# Altium schematic sheet M66 Quectel.SchDoc
size A2; SheetNumber: 1; SheetTotal: 1
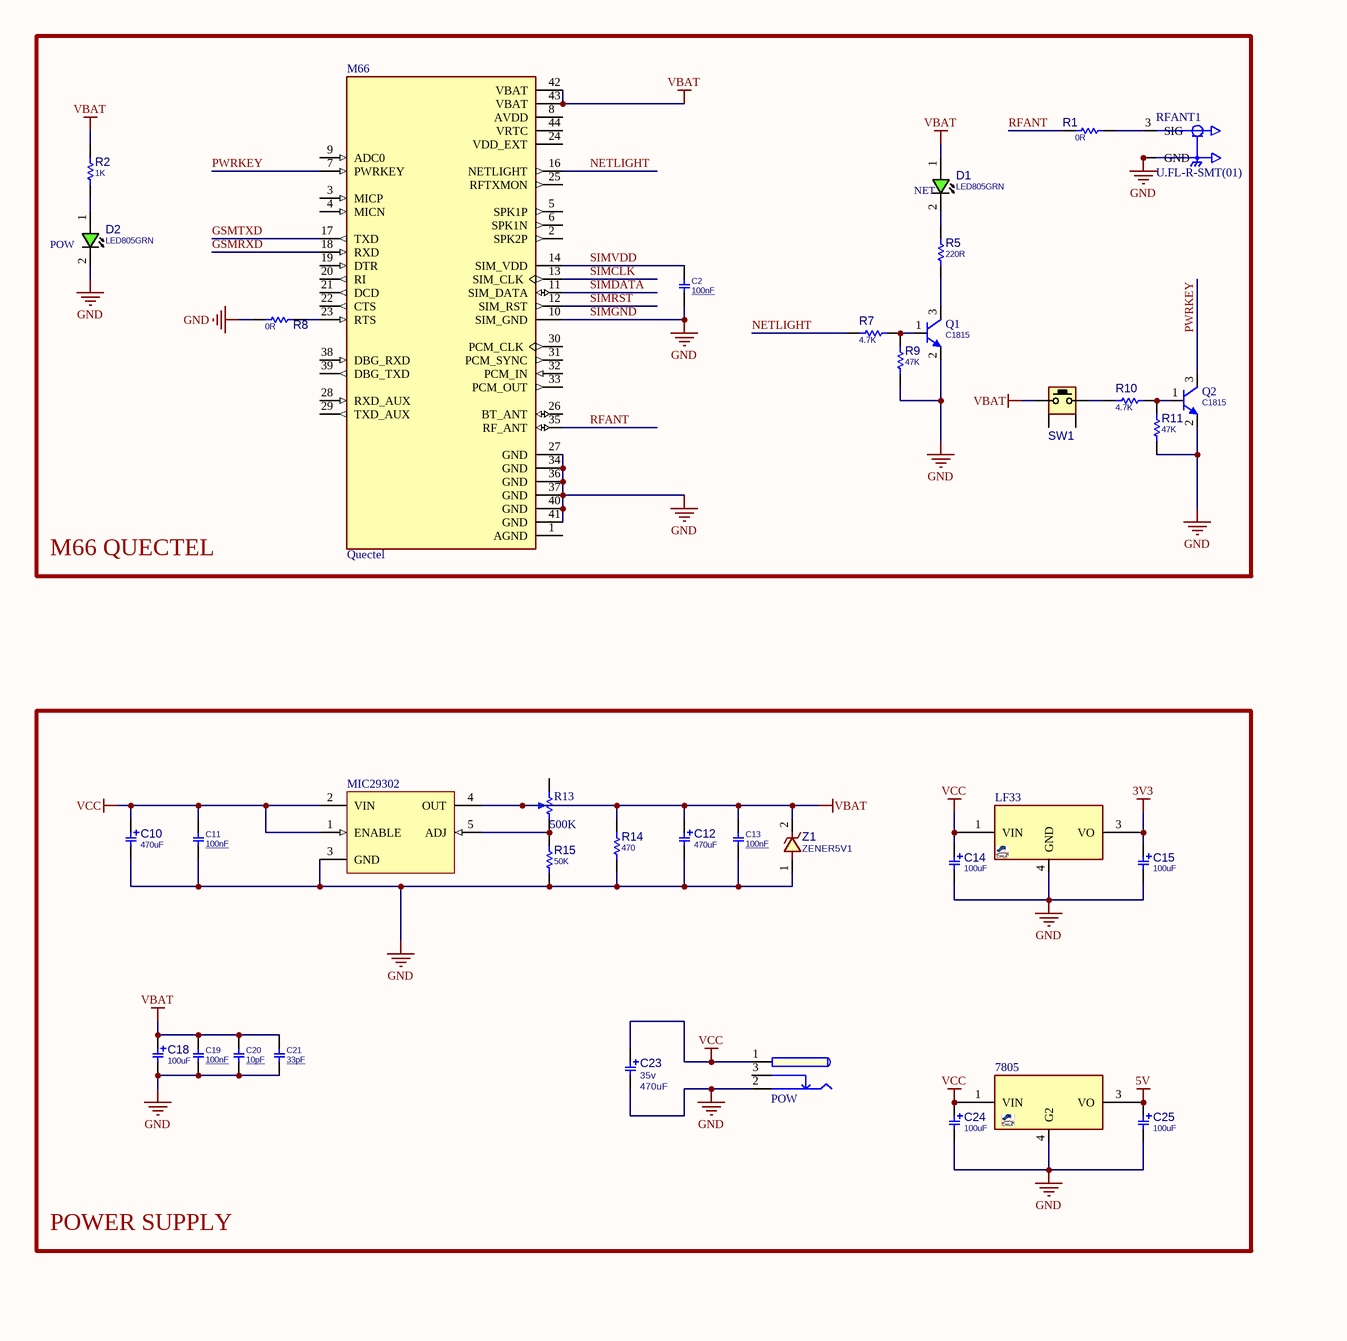
[diagram p0: M66 Quectel.SchDoc, left]
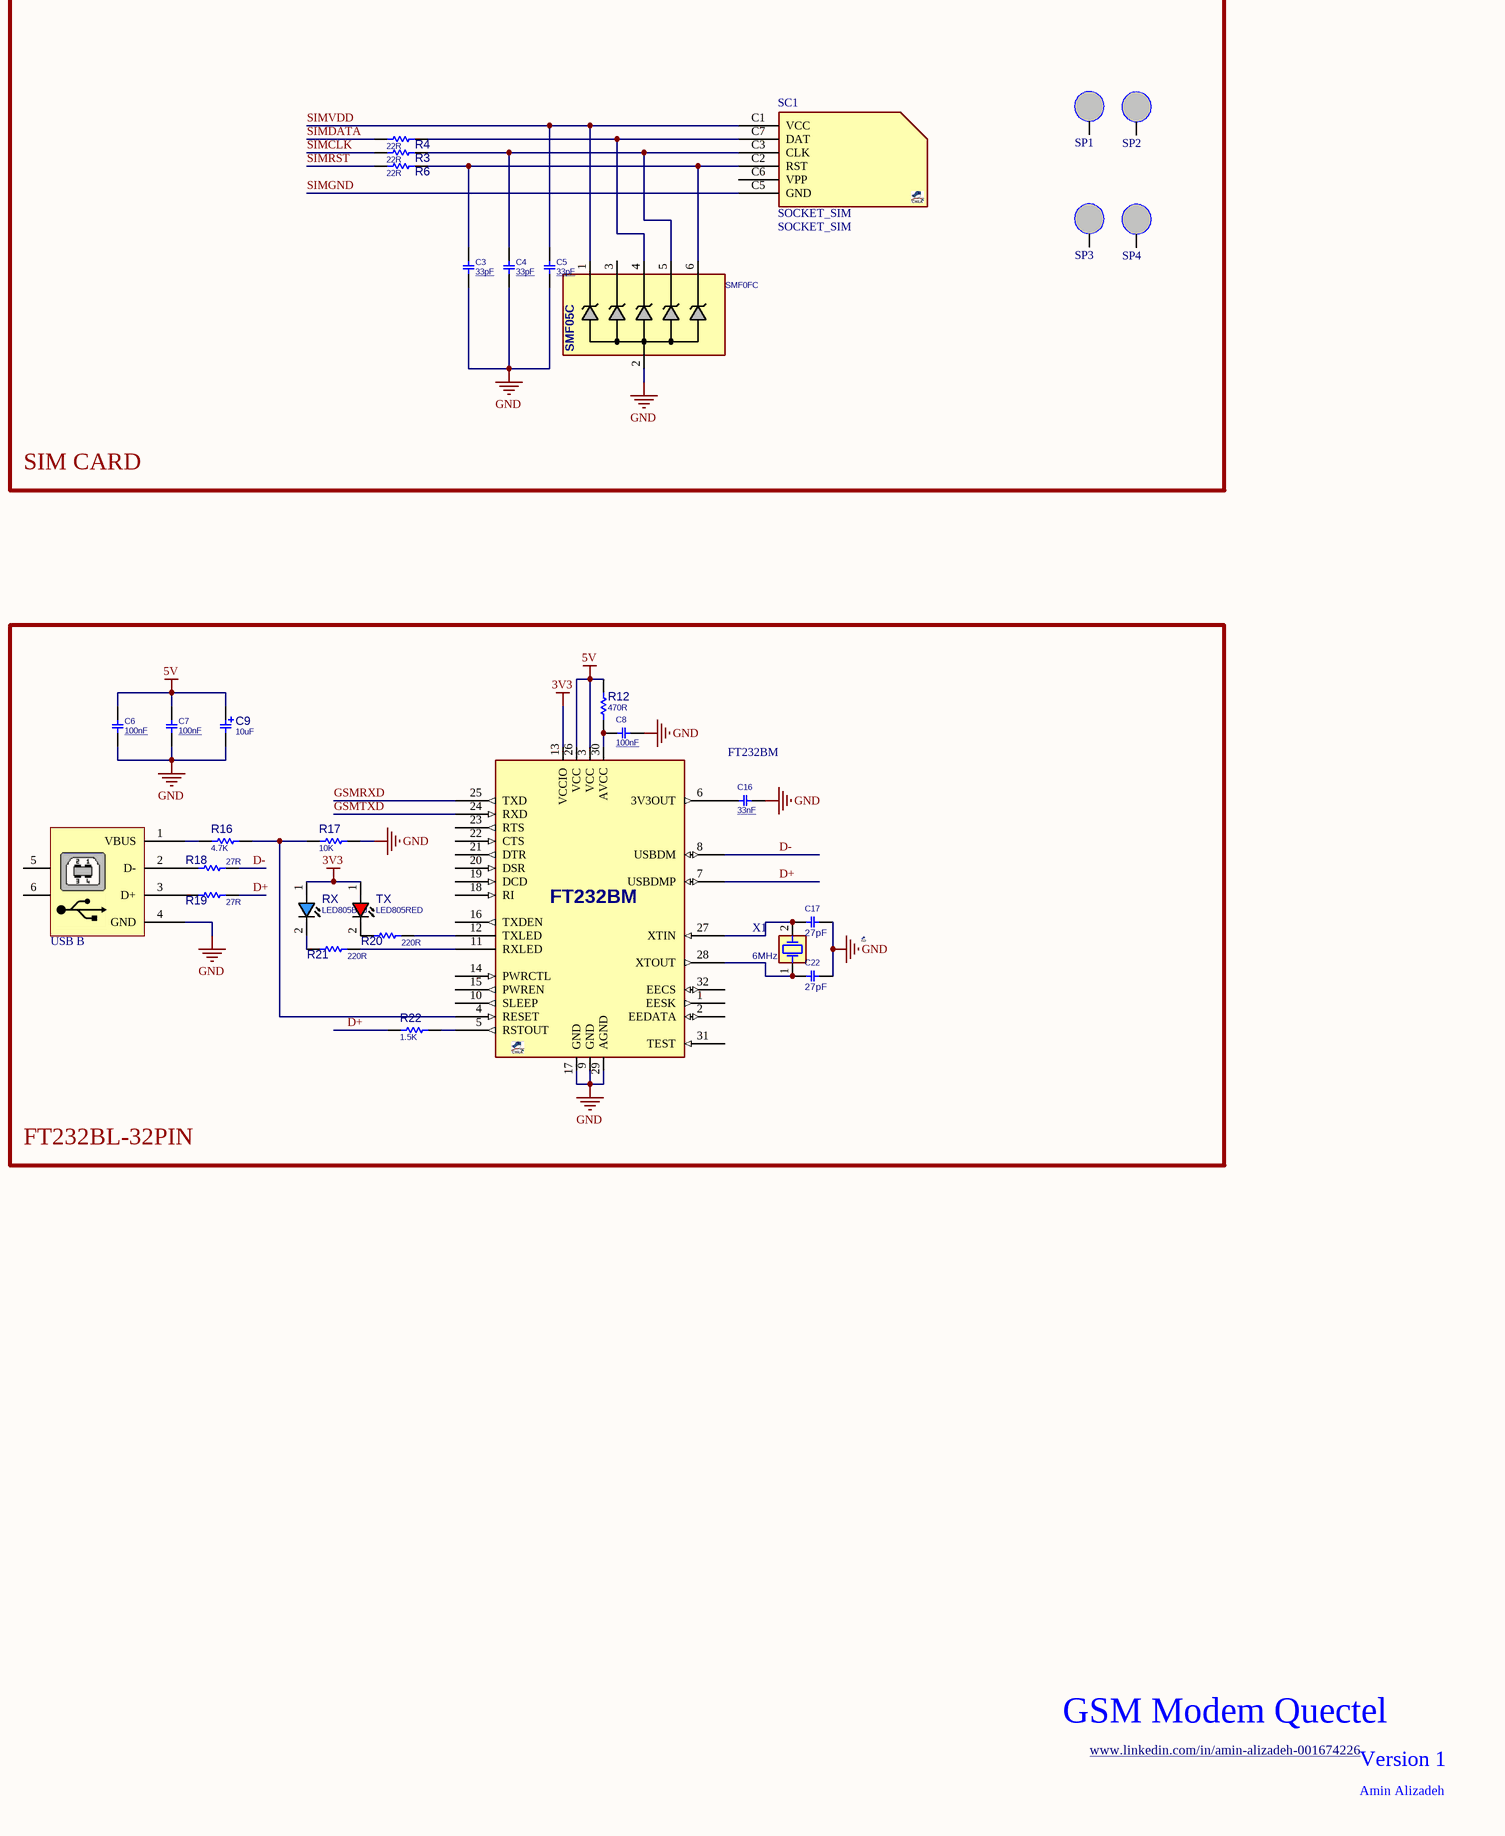
[diagram p1: M66 Quectel.SchDoc, right]

## Parts
7805  7805  [D2PAK_2]  (value not drawn)
C2  100nF  [C0805]
C3  33pF  [C0805]
C4  33pF  [C0805]
C5  33pF  [C0805]
C6  100nF  [C0805]
C7  100nF  [C0805]
C8  100nF  [C0805]
C9  10uF  [SMD_Cap_10x10]
C10  470uF  [SMD_Cap_10x10]
C11  100nF  [C0805]
C12  470uF  [SMD_Cap_10x10]
C13  100nF  [C0805]
C14  100uF  [Cap 5.3 x 6.3]
C15  100uF  [Cap 5.3 x 6.3]
C16  33nF  [C0805]
C17  27pF  [C0805]
C18  100uF  [SMD_Cap_10x10]
C19  100nF  [C0805]
C20  10pF  [C0805]
C21  33pF  [C0805]
C22  27pF  [C0805]
C23  PARAM2: 35v  [SMD_Cap_10x10]  (hidden comment: 470uF)
C24  100uF  [Cap 5.3 x 6.3]
C25  100uF  [Cap 5.3 x 6.3]
D1  NET  value LED805GRN  [LED0805GRN]
D2  POW  value LED805GRN  [LED0805GRN]
FT232BM  FT232BM  [QFG80_32]  (value not drawn)
LF33  LF33  [DPAK_3]  (value not drawn)
M66  Quectel  [XCVR_M66]
MIC29302  MIC29XX  [D2PAK_5]  (value not drawn)
POW  DC Power Jack  [DC_Power_Jack]  (value not drawn)
Q1  C1815  [SOT23_3]
Q2  C1815  [SOT23_3]
R1  0R  [R0805]
R2  1K  [R0805]
R3  22R  [R0805]
R4  22R  [R0805]
R5  220R  [R0805]
R6  22R  [R0805]
R7  4.7K  [R0805]
R8  0R  [R0805]
R9  47K  [R0805]
R10  4.7K  [R0805]
R11  47K  [R0805]
R12  470R  [R0805]
R13  value 500K  [POT_3296W]  (hidden comment: Multi_turn)
R14  470  [R0805]
R15  50K  [R0805]
R16  4.7K  [R0805]
R17  10K  [R0805]
R18  27R  [R0805]
R19  27R  [R0805]
R20  220R  [R0805]
R21  220R  [R0805]
R22  1.5K  [R0805]
RFANT1  U.FL-R-SMT(01)  [HRS_U.FL-R-SMT(01)]
RX  LED805BLU  [LED0805BLU]
SC1  SOCKET_SIM  [SIM_MINI_6JT]
SMF0FC  TVS_SMF05C  [SOT363_6]  (value not drawn)
SP1  Spacer  [my_space]  (value not drawn)
SP2  Spacer  [my_space]  (value not drawn)
SP3  Spacer  [my_space]  (value not drawn)
SP4  Spacer  [my_space]  (value not drawn)
SW1  POW ON  [SWPBT_SPST_R_6X6X10]  (value not drawn)
TX  LED805RED  [LED0805RED]
USB_B  USB_B  [USB_B.1]  (value not drawn)
X1  6MHz  [XTL_2_11X5]
Z1  ZENER5V1  [D_SOD123W]

## Blocks framed on the sheet
M66 QUECTEL: C2 D1 D2 M66 Q1 Q2 R1 R2 R5 R7-R11 RFANT1 SW1
SIM CARD: C3-C5 R3 R4 R6 SC1 SMF0FC SP1-SP4
POWER SUPPLY: 7805 C10-C15 C18-C21 C23-C25 LF33 MIC29302 POW R13-R15 Z1
FT232BL-32PIN: C6-C9 C16 C17 C22 FT232BM R12 R16-R22 RX TX USB_B X1

## Nets
3V3: C15.1 FT232BM.13(VCCIO) LF33.3(VO) RX.1(ANODE) TX.1(ANODE)
5V: 7805.3(VO) C6.1 C7.1 C9.1 C25.1 FT232BM.3(VCC) FT232BM.26(VCC) R12.2
SIMGND: 7805.4(G2) C2.1 C3.1 C4.1 C5.1 C6.2 C7.2 C8.1 C9.2 C10.2 C11.1 C12.2 C13.1 C14.2 C15.2 C16.2 C17.1 C18.2 C19.1 C20.1 C21.1 C22.1 C23.2 C24.2 C25.2 D2.2(CATHODE) FT232BM.9(GND) FT232BM.17(GND) FT232BM.29(AGND) LF33.4(GND) M66.10(SIM_GND) M66.27(GND) M66.34(GND) M66.36(GND) M66.37(GND) M66.40(GND) M66.41(GND) MIC29302.3(GND) POW.2(GND) Q1.2(E) Q2.2(E) R8.2 R9.1 R11.1 R14.1 R15.1 R17.2 RFANT1.1(GND) RFANT1.2(GND) SC1.C5(GND) SMF0FC.2 USB_B.4(GND) Z1.1  [also labelled GND]
VBAT: C12.1 C13.2 C18.1 C19.2 C20.2 C21.2 D1.1(ANODE) M66.42(VBAT) M66.43(VBAT) MIC29302.4(OUT) R2.2 R13.3(TAP) R14.2 SW1.1 Z1.2
VCC: 7805.1(VIN) C10.1 C11.2 C14.1 C23.1 C24.1 LF33.1(VIN) MIC29302.1(ENABLE) MIC29302.2(VIN) POW.1(V+)
D+: FT232BM.7(USBDMP) R19.1 R22.2
D-: FT232BM.8(USBDM) R18.1
GSMRXD: FT232BM.25(TXD) M66.18(RXD)
GSMTXD: FT232BM.24(RXD) M66.17(TXD)
NETLIGHT: M66.16(NETLIGHT) R7.2
PWRKEY: M66.7(PWRKEY) Q2.3(C)
RFANT: M66.35(RF_ANT) R1.2
SIMCLK: M66.13(SIM_CLK) R3.2
SIMDATA: M66.11(SIM_DATA) R4.2
SIMRST: M66.12(SIM_RST) R6.2
SIMVDD: C2.2 C5.2 M66.14(SIM_VDD) SC1.C1(VCC) SMF0FC.1
NetC3_2: C3.2 R6.1 SC1.C2(RST) SMF0FC.6
NetC4_2: C4.2 R3.1 SC1.C3(CLK) SMF0FC.5
NetC8_2: C8.2 FT232BM.30(AVCC) R12.1
NetC16_1: C16.1 FT232BM.6(3V3OUT)
NetC17_2: C17.2 FT232BM.27(XTIN) X1.2(OSC2)
NetC22_2: C22.2 FT232BM.28(XTOUT) X1.1(OSC1)
NetD1_2: D1.2(CATHODE) R5.2
NetD2_1: D2.1(ANODE) R2.1
NetFT232BM_4: FT232BM.4(RESET) R16.2 R17.1
NetFT232BM_5: FT232BM.5(RSTOUT) R22.1
NetFT232BM_11: FT232BM.11(RXLED) R21.1
NetFT232BM_12: FT232BM.12(TXLED) R20.1
NetM66_23: M66.23(RTS) R8.1
NetMIC29302_5: MIC29302.5(ADJ) R13.2(BOT) R15.2
NetQ1_1: Q1.1(B) R7.1 R9.2
NetQ1_3: Q1.3(C) R5.1
NetQ2_1: Q2.1(B) R10.1 R11.2
NetR1_1: R1.1 RFANT1.3(SIG)
NetR4_1: R4.1 SC1.C7(DAT) SMF0FC.4
NetR10_2: R10.2 SW1.2
NetR16_1: R16.1 USB_B.1(VBUS)
NetR18_2: R18.2 USB_B.2(D-)
NetR19_2: R19.2 USB_B.3(D+)
NetR20_2: R20.2 TX.2(CATHODE)
NetR21_2: R21.2 RX.2(CATHODE)

Not connected (* = marked no-connect by the designer): FT232BM 1(EESK) 2(EEDATA) 10(SLEEP) 14(PWRCTL) 15(PWREN) 16(TXDEN) 18(RI) 19(DCD) 20(DSR) 21(DTR) 22(CTS) 23(RTS) 31(TEST) 32(EECS); M66 1(AGND) 2(SPK2P) 3(MICP) 4(MICN) 5(SPK1P) 6(SPK1N) 8(AVDD) 9(ADC0) 19(DTR) 20(RI) 21(DCD) 22(CTS) 24(VDD_EXT) 25(RFTXMON) 26(BT_ANT) 28(RXD_AUX) 29(TXD_AUX) 30(PCM_CLK) 31(PCM_SYNC) 32(PCM_IN) 33(PCM_OUT) 38(DBG_RXD) 39(DBG_TXD) 44(VRTC); POW 3(GND1); R13 1(TOP); SC1 C6(VPP); SMF0FC 3; SP1 0; SP2 0; SP3 0; SP4 0; SW1 MH1 MH2; USB_B 5 6

## Notes on the sheet
- GSM Modem Quectel
- www.linkedin.com/in/amin-alizadeh-001674226 <http://www.linkedin.com/in/amin-alizadeh-001674226>
- Version 1
- Amin Alizadeh
- (in symbol TVS_X5_SMF05C) SMF05C

## Library data of the parts
7805 = VREG_L7805A_TO263: REG, Linear, Fixed, 5v, 1A, TO-263; MANF_P#: L7805ABD2T; MANF: TI; PARAM2: 7.5~25vIn, 5vOut; PARAM: 1A; VALUE: 7805
C2-C8 C11 C13 C16 C19-C21 = CAP_SMD_MLCC_0805: CAP, MLCC, -F, -V, MATERIAL, -%, 0201; PARAM: -, -%; MANF_P#: MANF_PART#; PRICE: 100= 1$; MANF: -; PARAM2: -V; ASSEMBLY: ASSEMBLY
  C2 C6-C8 C11 C13 C19: VALUE: 100nF
  C3-C5 C21: VALUE: 33pF
  C16: VALUE: 33nF
  C20: VALUE: 10pF
C9 C10 C12 C18 = CAP_SMD_EL_8: CAP, THD, ELEC,; MANF_P#: MANF_PART#; PARAM2: -V; DESC: DESCRIPTION; DIST#: MOUSER; PARAM: 20%; PRICE: 10= -$; MANF: MANF; ASSEMBLY: ASSEMBLY
  C9: VALUE: 10uF
  C10 C12: VALUE: 470uF
  C18: VALUE: 100uF
C14 C15 C24 C25 = CAP_SMD_EL_5: CAP, THD, ELEC,; MANF_P#: MANF_PART#; DESC: DESCRIPTION; DIST#: MOUSER; PARAM: 20%; PARAM2: -V; PRICE: 10= -$; MANF: MANF; ASSEMBLY: ASSEMBLY; VALUE: 100uF
C17 C22 = CAP_SMD_MLCC_0805: CAP, MLCC; PARAM: -, -%; MANF_P#: MANF_PART#; PARAM2: -V; PRICE: 100= 1$; MANF: -; ASSEMBLY: ASSEMBLY; VALUE: 27pF
C23 = CAP_SMD_EL_470uF_35v: CAP, SMD, ELEC,; MANF_P#: MANF_PART#; DESC: DESCRIPTION; DIST#: MOUSER; PARAM: 20%; PRICE: 10= -$; MANF: MANF; ASSEMBLY: ASSEMBLY; VALUE: 470uF
D1 D2 = LED_SMD_0805_GRN: LED, SMD, 0805, GREEN; PARAM: 20mA; DESC: DESCRIPTION; PARAM2: 2.2V; MANF: -; ASSEMBLY: ASSEMBLY; PRICE: 36t@Javan; MANF_P#: -
FT232BM = FT232BM_QFP32: USB-UART; MANF: FTDI; MANF_P#: FT232BM; VALUE: FT232BM
LF33 = VREG_LFXX_TO252: REG, Linear, LDO0.45V, 0.5A, TO-252; MANF: ST; PARAM2: 1.5/1.8/2.5/3.3/5V; MANF_P#: LF33; PARAM: LDO0.45V, 0.5A; PRICE: 1500t; VALUE: LF33
M66 = M66: M66 is an ultra-small quad-band GSM/GPRS module using LCC castellation packaging on the market. Based on the latest 2G chipset, it has the optimal performance in SMS & Data transmission and audio service even in harsh environment.; Availability: In Stock; Value: *; Price: None; Check_prices: https://www.snapeda.com/parts/M66/Quectel/view-part/?ref=eda; SnapEDA_Link: https://www.snapeda.com/parts/M66/Quectel/view-part/?ref=snap; MF: Quectel; MP: M66; Package: SMD-52 Quectel
MIC29302 = MIC29302: High-Current Low-Dropout Regulators
POW = DC_Power_Jack
Q1 Q2 = NPN_C1815_SOT23: BJT, NPN, 50v, 0.15A, SMD, SOT23; PARAM2: 250mW; PARAM: 50v, 0.15A; MANF_P#: C1815; MANF: -; VALUE: C1815
R1-R12 R14-R22 = RES_SMD_0805: RESISTOR, SMD; PARAM: -W; DESC: DESCRIPTION; DIST#: MOUSER; PARAM2: 1%; MANF_P#: -; MANF: -; ASSEMBLY: ASSEMBLY; PRICE: 100= 0.5$
  R1 R8: VALUE: 0R
  R2: VALUE: 1K
  R3 R4 R6: VALUE: 22R
  R5 R20 R21: VALUE: 220R
  R7 R10 R16: VALUE: 4.7K
  R9 R11: VALUE: 47K
  R12: VALUE: 470R
  R14: VALUE: 470
  R15: VALUE: 50K
  R17: VALUE: 10K
  R18 R19: VALUE: 27R
  R22: VALUE: 1.5K
R13 = Multi_turn: Potentiometer MULTI TURN; Sim Note: Enter the Resistance value and the set point into parameter fields.; Set Position: 0.5; Published: 8-Jun-2000; LatestRevisionDate: 17-Jul-2002; LatestRevisionNote: Re-released for DXP Platform.; PackageReference: VR5; Publisher: Altium Limited
RFANT1 = U.FL-R-SMT(01): U.FL (UMCC) Connector Receptacle, Male Pin 50Ohm Surface Mount Solder. RF Connectors / Coaxial Connectors; MF: Hirose; Check_prices: https://www.snapeda.com/parts/U.FL-R-SMT(01)/Hirose+Electric+Co+Ltd/view-part/?ref=eda; Value: *; Availability: In Stock; MP: U.FL-R-SMT(01); Price: None; Package: None; SnapEDA_Link: https://www.snapeda.com/parts/U.FL-R-SMT(01)/Hirose+Electric+Co+Ltd/view-part/?ref=snap; Purchase-URL: https://pricing.snapeda.com/search/part/U.FL-R-SMT(01)/?ref=eda
RX = LED_SMD_0805_BLU: LED, SMD, 0805, BLUE; DESC: DESCRIPTION; MANF_P#: MANF_PART#; PARAM2: 2.2V; MANF: MANF; ASSEMBLY: ASSEMBLY; PRICE: 36t@Javan; VALUE: LED805BLU
SC1 = SIM_MINI_6_JT: SOCKET, SIM MINI, PUSH-PULL, exist on Iran; MANF: JTCONN; MANF_P#: -; PRICE: 750toman@roboeq; VALUE: SOCKET_SIM
SMF0FC = TVS_X5_SMF05C: TVS, ESD PROTECT, 5CH, 5VRWM, 15KV; MANF_P#: SMF05C, SMF05CT1G; MANF: Semtech, ON; PARAM: 5VRWM, 15KV; VALUE: TVS_SMF05C
SP1-SP4 = Spacer: 10MM SPACER
SW1 = SWPBT_SPST_R_6X6X10: SWITCH, PUSH BUTTON, TACTILE, THD, SPST, RIGHT; PARAM: 50mA/12VDC; DESC: DESCRIPTION; MANF: -; VALUE: POW ON; ASSEMBLY: ASSEMBLY; PRICE: 0.3$; MANF_P#: -
TX = LED_SMD_0805_RED: LED, SMD, 0805, RED; DESC: DESCRIPTION; MANF_P#: MANF_PART#; PARAM2: 2.2V; MANF: MANF; ASSEMBLY: ASSEMBLY; PRICE: 36t@Javan; VALUE: LED805RED
USB_B = USB_B: USB B; LatestRevisionDate: 17-Jul-2002; LatestRevisionNote: Re-released for DXP Platform.; Publisher: Altium Limited
X1 = XTL_2_HC49_8MHz_SMD: Crystal MOST POPULAR ABL HC49 PACKAGE; MANF: ABRACON; MANF_P#: ABLS-8.000MHZ-B4-T; PARAM: 8MHz, 18pF, 30PPM, -20~70oC; PRICE: 0.3$; VALUE: 6MHz
Z1 = DIODE_SMD_ZENER_BZT52HC5V1: DIODE, ZENER, 1W, 5.1V; MANF: Diodes; DESC: DESCRIPTION; PARAM2: 1W, 4Ohm, -55~150oC; MANF_P#: BZT52HC5V1WF-7; ASSEMBLY: ASSEMBLY; PRICE: 0.25$; PARAM: 5.1V; VALUE: ZENER5V1